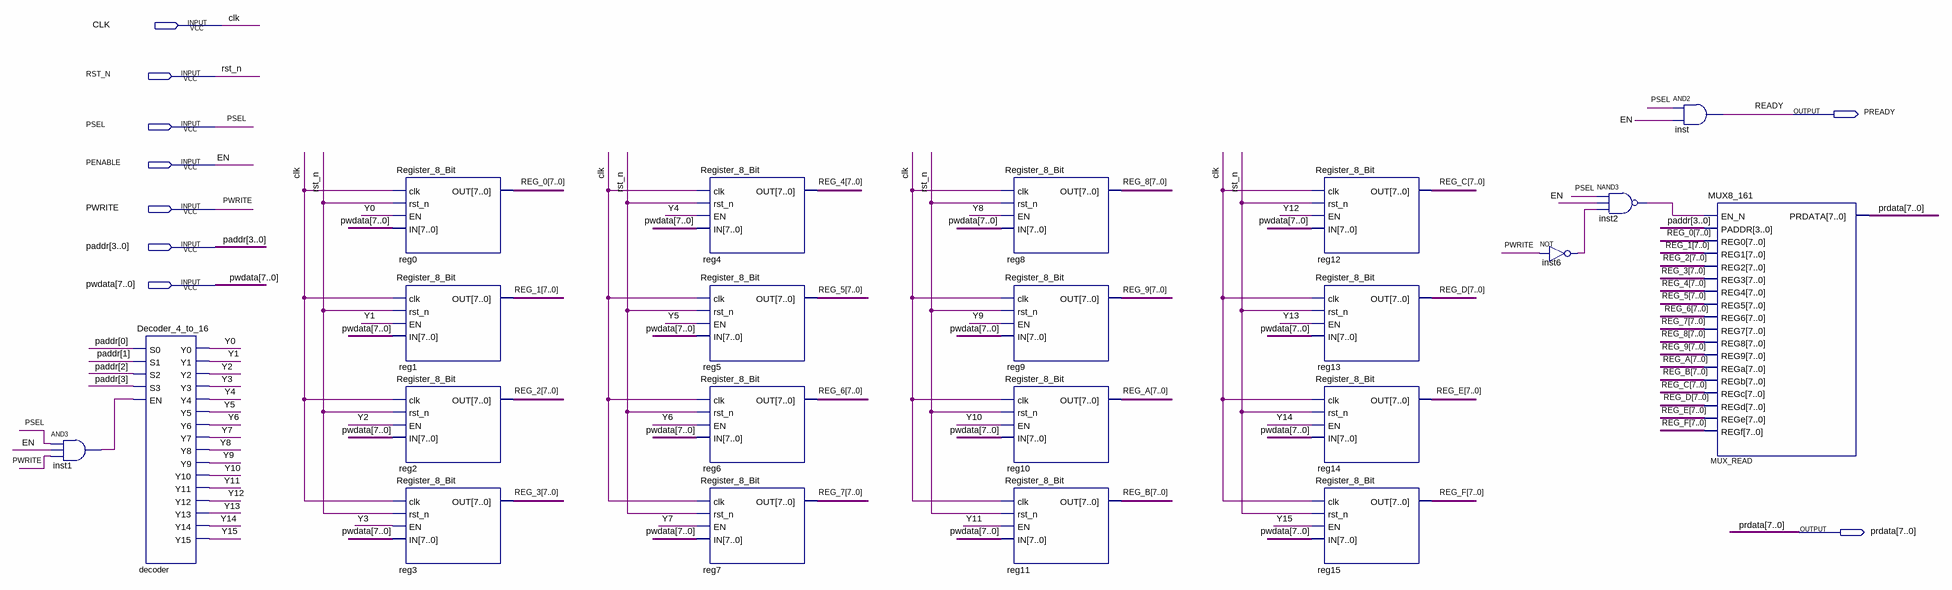
[diagram p0: schematic sheet]
// Quartus schematic SLAVE.bdf as structural Verilog: 22 symbols, 9 pins
module SLAVE (
  input  CLK,
  input  RST_N,
  input  PSEL,
  input  PENABLE,
  input  PWRITE,
  input  [3:0] paddr,
  input  [7:0] pwdata,
  output PREADY,
  output [7:0] prdata
);

  wire inst1_out, inst2_out, inst6_out, Y0, Y1, Y2, Y3, Y4, Y5, Y6, Y7, Y8, Y9, Y10, Y11, Y12, Y13, Y14, Y15;
  wire [7:0] REG_0, REG_1, REG_2, REG_3, REG_4, REG_5, REG_6, REG_7, REG_8, REG_9, REG_A, REG_B, REG_C,
       REG_D, REG_E, REG_F;

  and inst1 (inst1_out, PSEL, PENABLE, PWRITE);
  Decoder_4_to_16 decoder (
    .S0(paddr[0]), .S1(paddr[1]), .S2(paddr[2]), .S3(paddr[3]), .EN(inst1_out), .Y0(Y0), .Y1(Y1), .Y2(Y2),
    .Y3(Y3), .Y4(Y4), .Y5(Y5), .Y6(Y6), .Y7(Y7), .Y8(Y8), .Y9(Y9), .Y10(Y10), .Y11(Y11), .Y12(Y12),
    .Y13(Y13), .Y14(Y14), .Y15(Y15));
  Register_8_Bit reg0 (.clk(CLK), .rst_n(RST_N), .EN(Y0), .IN(pwdata), .OUT(REG_0));
  Register_8_Bit reg1 (.clk(CLK), .rst_n(RST_N), .EN(Y1), .IN(pwdata), .OUT(REG_1));
  Register_8_Bit reg2 (.clk(CLK), .rst_n(RST_N), .EN(Y2), .IN(pwdata), .OUT(REG_2));
  Register_8_Bit reg3 (.clk(CLK), .rst_n(RST_N), .EN(Y3), .IN(pwdata), .OUT(REG_3));
  Register_8_Bit reg4 (.clk(CLK), .rst_n(RST_N), .EN(Y4), .IN(pwdata), .OUT(REG_4));
  Register_8_Bit reg5 (.clk(CLK), .rst_n(RST_N), .EN(Y5), .IN(pwdata), .OUT(REG_5));
  Register_8_Bit reg6 (.clk(CLK), .rst_n(RST_N), .EN(Y6), .IN(pwdata), .OUT(REG_6));
  Register_8_Bit reg7 (.clk(CLK), .rst_n(RST_N), .EN(Y7), .IN(pwdata), .OUT(REG_7));
  Register_8_Bit reg8 (.clk(CLK), .rst_n(RST_N), .EN(Y8), .IN(pwdata), .OUT(REG_8));
  Register_8_Bit reg9 (.clk(CLK), .rst_n(RST_N), .EN(Y9), .IN(pwdata), .OUT(REG_9));
  Register_8_Bit reg10 (.clk(CLK), .rst_n(RST_N), .EN(Y10), .IN(pwdata), .OUT(REG_A));
  Register_8_Bit reg11 (.clk(CLK), .rst_n(RST_N), .EN(Y11), .IN(pwdata), .OUT(REG_B));
  Register_8_Bit reg12 (.clk(CLK), .rst_n(RST_N), .EN(Y12), .IN(pwdata), .OUT(REG_C));
  Register_8_Bit reg13 (.clk(CLK), .rst_n(RST_N), .EN(Y13), .IN(pwdata), .OUT(REG_D));
  Register_8_Bit reg14 (.clk(CLK), .rst_n(RST_N), .EN(Y14), .IN(pwdata), .OUT(REG_E));
  Register_8_Bit reg15 (.clk(CLK), .rst_n(RST_N), .EN(Y15), .IN(pwdata), .OUT(REG_F));
  not inst6 (inst6_out, PWRITE);
  nand inst2 (inst2_out, PSEL, PENABLE, inst6_out);
  and inst (PREADY, PSEL, PENABLE);
  MUX8_161 MUX_READ (
    .EN_N(inst2_out), .PADDR(paddr), .REG0(REG_0), .REG1(REG_1), .REG2(REG_2), .REG3(REG_3), .REG4(REG_4),
    .REG5(REG_5), .REG6(REG_6), .REG7(REG_7), .REG8(REG_8), .REG9(REG_9), .REGa(REG_A), .REGb(REG_B),
    .REGc(REG_C), .REGd(REG_D), .REGe(REG_E), .REGf(REG_F), .PRDATA(prdata));

  // Other names for the same wires on the sheet: EN = PENABLE; READY = PREADY
endmodule
